# Altium schematic sheet Power.SchDoc
size A4
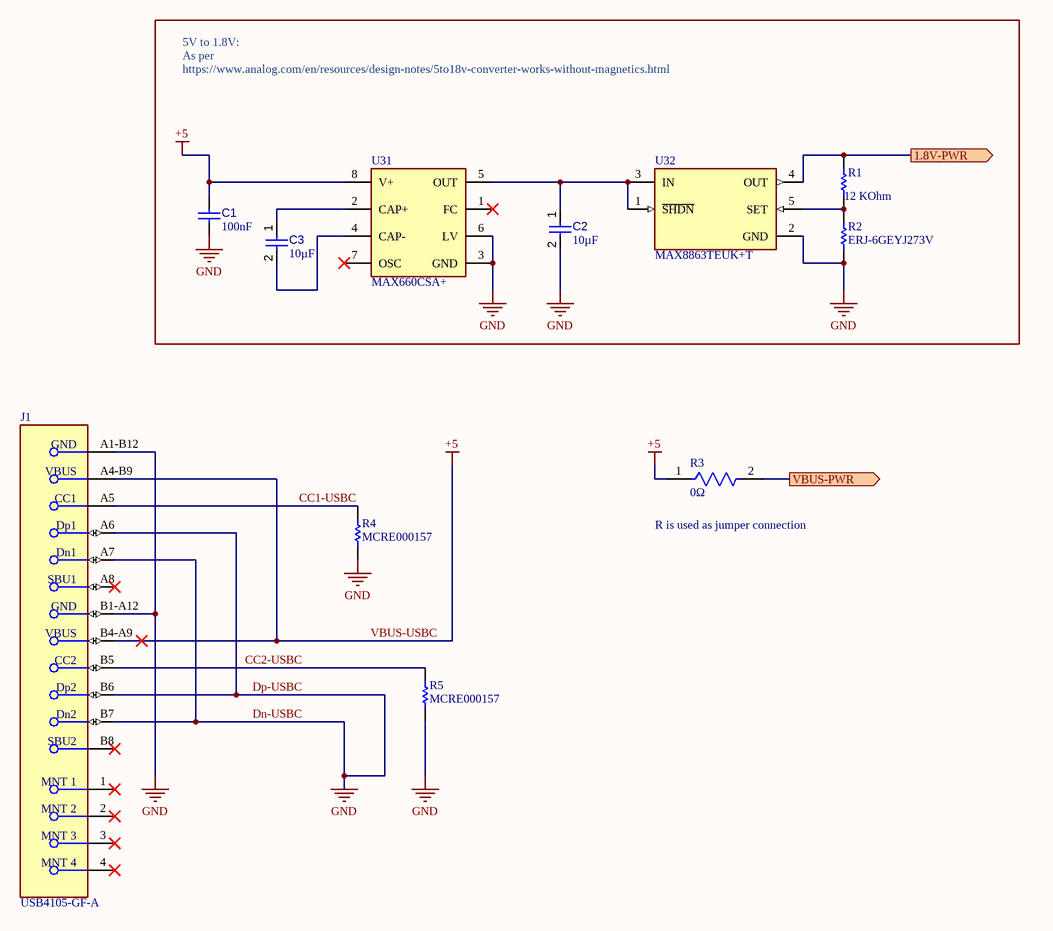
[diagram p0: Power.SchDoc]

## Parts
C1  value 100nF  [CAPC1005X56X25LL10T15]  (hidden comment: Capacitor 0.1 uF +/- 5% 16 V 0402)
C2  value 10µF  [CAPC2013X135X45NL10T25]  (hidden comment: Capacitor 10 uF +/- 10% 16 V 0805)
C3  value 10µF  [CAPC2013X135X45NL10T25]  (hidden comment: Capacitor 10 uF +/- 10% 16 V 0805)
J1  USB4105-GF-A  [FP-USB4105-GF-A-MFG]
R1  Resistance: 12 KOhm  [RESC1005X40X25ML05T05]  (hidden comment: ERJ-2RKF1202X)
R2  ERJ-6GEYJ273V  [RESC2013X70X40NL20T20]
R3  0Ω  [FP-CRCW1206-C-e3-MFG]
R4  MCRE000157  [RESC0603X26X15NL03T05]
R5  MCRE000157  [RESC0603X26X15NL03T05]
U31  MAX660CSA+  [FP-S8-4-MFG]
U32  MAX8863TEUK+T  [FP-U5-1-IPC_C]

## Ports
1.8V-PWR (out), VBUS-PWR (out)

## Nets
Dn-USBC: C1.2 C2.2 J1.A1-B12(GND) J1.A6(Dp1) J1.A7(Dn1) J1.B1-A12(GND) J1.B6(Dp2) J1.B7(Dn2) R2.2 R4.2 R5.2 U31.3(GND) U31.6(LV) U32.2(GND)  [also labelled Dp-USBC, GND]
VBUS-USBC: C1.1 J1.A4-B9(VBUS) J1.B4-A9(VBUS) R3.1 U31.8(V+)  [also labelled +5]
1.8V-PWR: R1.1 U32.4(OUT) ; port 1.8V-PWR
CC1-USBC: J1.A5(CC1) R4.1
CC2-USBC: J1.B5(CC2) R5.1
VBUS-PWR: R3.2 ; port VBUS-PWR
NetC2_1: C2.1 U31.5(OUT) U32.1(~{SHDN}) U32.3(IN)
NetC3_1: C3.1 U31.2(CAP+)
NetC3_2: C3.2 U31.4(CAP-)
NetR1_2: R1.2 R2.1 U32.5(SET)

Not connected (* = marked no-connect by the designer): J1 1(MNT_1)* 2(MNT_2)* 3(MNT_3)* 4(MNT_4)* A8(SBU1)* B8(SBU2)*; U31 1(FC)* 7(OSC)*

## Notes on the sheet
- 5V to 1.8V:
  As per https://www.analog.com/en/resources/design-notes/5to18v-converter-works-without-magnetics.html
- Type @ to refer to a designator
- (near R3) R is used as jumper connection

## Library data of the parts
C1 = CMP-001-00001-6: Chip Capacitor, 0.1 uF, +/- 5%, 16 V, 0402 (1005 Metric); Capacitor Type: Ceramic; Voltage Rating: 16V; Max Operating Temperature: 125°C; Min Operating Temperature: -55°C; Case/Package: 0402; Mounting Technology: SM; Pins: 2; Tolerance: 5%; RoHS Compliant: True
C2 C3 = CMP-001-00015-6: Chip Capacitor, 10 uF, +/- 10%, 16 V, 0805 (2012 Metric); Voltage Rating: 16V; Capacitor Type: Ceramic; RoHS Compliant: True; Max Operating Temperature: 85°C; Min Operating Temperature: -55°C; Mounting Technology: SM; Tolerance: 10%; Case/Package: 0805; Pins: 2
J1 = CMP-245163-000001-1: CONN RCPT USB2.0 TYPEC 5A; Manufacturer: GCT; Description: USB - C (Type - C) USB 2.0 Receptacle Connector 24 Position Surface Mount, Right Angle; Through Hole; Voltage Rating: 20V; Is Female: yes; Current Rating: 5/6.25/1.25/0.25A; Number Of Contacts: 16; Conn Orientation: Right Angle; Device Class L1: Connectors; Category: Conn; Lead Free: Yes; RoHS: TRUE; Temperature Range High: +85°C; Digikey Description: CONN RCPT USB2.0 TYPEC 5A; Device Class L3: unset; ComponentLink2Description: Datasheet; Manufacturer Part Number: USB4105-GF-A; Package: 0; Usb Standard: USB 2.0; Device Class L2: USB Connectors; Automotive: No; Temperature Range Low: -40°C; Height: 3.46mm; Temperature: -40°C to +85°C; Contact Material: Gold,Nickel; ComponentLink2URL: https://gct.co/files/drawings/usb4105.pdf; Octopart: https://octopart.com/usb4105-gf-a-gct-106627878
R1 = CMP-2002-00646-4: Chip Resistor, 12 KOhm, +/- 1%, 0.1 W, -55 to 155 degC, 0402 (1005 Metric), RoHS, Tape and Reel; Voltage Rating: 50 V; Case\/Package: 0402; Power Rating: 100 mW; Length: 1 mm; PackageReference: 0402; DatasheetVersion: 04/2015; ComponentLink2Description: Datasheet; ComponentLink1URL: http://www.panasonic.com/; Pins: 2; Width: 0.5 mm; REACH SVHC: Yes; Packaging: Tape and Reel; Min Operating Temperature: -55 degC; Mounting Technology: Surface Mount; Max Operating Temperature: 155 degC; Case Code (Imperial): 0402; Height: 0.35 mm; Tolerance: 1%; PackageDescription: 2-Pin Surface Mount Device, Body 1 x 0.5 mm; RoHSCompliant: true; ComponentLink1Description: Manufacturer URL; Mount: Surface Mount; ComponentLink2URL: http://industrial.panasonic.com/cdbs/www-data/pdf/RDA0000/AOA0000C86.pdf; Package Quantity: 10000; Case Code (Metric): 1005; PartNumber: ERJ-2RKF1202X
R2 = CMP-2001-00388-1: Manufacturer: Panasonic; Part Number: ERJ-6GEYJ273V
R3 = CMP-02407-011547-1: CRCW12060000Z0EAC - RES 0 OHM JUMPER 1/4W 1206; Resistance: 20R; Power Rating: 250mW; Mount: Surface Mount; Contact Plating: Tin; Min Operating Temperature: -55°C; Case/Package: Molded; Lead Free: Lead Free; RoHS Compliant: Yes; Length: 3.2mm; Max Operating Temperature: 155°C; Termination: Wraparound; Resistor Type: Thick Film
R4 R5 = CMP-2004-02525-1: Manufacturer: Multicomp; Part Number: MCRE000157
U31 = CMP-05722-000124-1: IC REG CHARGE PUMP INV 8SOIC; Manufacturer: Maxim Integrated; Description: IC REG SWTCHD CAP INV 0.1A 8SOIC; Max Supply Voltage: 5.5V; Min Supply Voltage: 1.5V; Max Power Dissipation: 471mW; Switching Frequency: 10/80kHz; Output Voltage: -5.5/+11V; Output Type: Other; Number Of Outputs: 1; Standoff Height: 0.1mm; Output Current: 100mA; Negative Voltage Available: true; Nominal Supply Current: 0.12-1mA; Device Class L2: Power Management ICs; Switching Topology: Charge Pump; Height: 1.75mm; ComponentLink2URL: https://datasheets.maximintegrated.com/en/ds/MAX660.pdf; Category: IC; Temperature Range High: +70°C; RoHS: TRUE; Temperature Range Low: 0°C; Mouser Description: Switching Voltage Regulators CMOS Monolithic Voltage Converter; ComponentLink2Description: Datasheet; Device Class L1: Integrated Circuits (ICs); Package: S8-4; Manufacturer Part Number: MAX660CSA+; Octopart: https://octopart.com/max660csa%2B-maxim+integrated-39436905; Footprint Url: https://pdfserv.maximintegrated.com/land_patterns/90-0096.PDF; Device Class L3: Voltage Regulators - Switching; Temperature: 0°C to +70°C; Lead Free: Yes; Automotive: No; Digikey Description: IC REG CHARGE PUMP INV 8SOIC
U32 = CMP-05721-000030-1: IC REG LIN POS ADJ 120MA SOT23-5; Min Input Voltage: 2.5V; Max Power Dissipation: 571mW; Output Voltage: 6.5V; Reference Voltage: 1.275V; Output Type: Fixed; Polarity: Positive; Number of Outputs: 1; Input Bias Current: 80uA; Nominal Output Voltage: 3.15V; Dropout Voltage: 55mV; Min Operating Temperature: -40°C; Lead Free: Lead Free; Radiation Hardening: No; Case/Package: SOT-23; Output Current: 120mA; Mount: Surface Mount; Max Input Voltage: 6.5V; Series: -; Package Quantity: 1; RoHS Compliant: Yes; Number of Regulators: 1; Packaging: Tape and Reel; Max Operating Temperature: 85°C; Number of Pins: 5